# Altium project Hefesto.PrjPcb
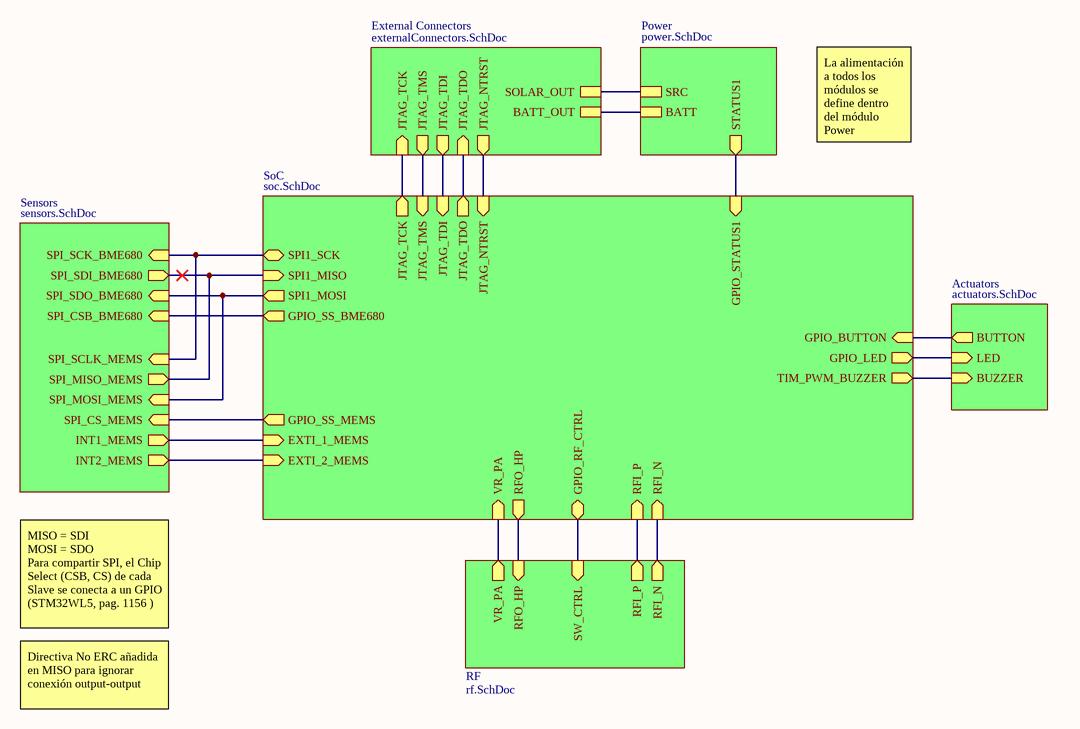
[diagram p0: main.SchDoc]
7 sheets, 68 parts. Net scope: hierarchical (ports join the sheet entries above them; power ports are global).
Board file: Hefesto.PcbDoc
Sheets:
  main.SchDoc
    SoC = soc.SchDoc
    Power = power.SchDoc
    RF = rf.SchDoc
    Actuators = actuators.SchDoc
    Sensors = sensors.SchDoc
    External Connectors = externalConnectors.SchDoc

## Sheet main.SchDoc: Hefesto
size A4; CheckedBy: None; DrawnBy: David, Andrea; DocumentNumber: 1; Revision: v1.0; SheetNumber: 1; SheetTotal: 7; Company: ETSIT; VersionRevision: v1.0; Project: Hefesto; TotalSheet: 7

### Sub-sheets
Actuators = actuators.SchDoc: BUTTON (out), LED (in), BUZZER (in)
External Connectors = externalConnectors.SchDoc: SOLAR_OUT, BATT_OUT, JTAG_TCK (in), JTAG_TMS (out), JTAG_TDI (out), JTAG_TDO (in), JTAG_NTRST (out)
Power = power.SchDoc: SRC, BATT, STATUS1 (out)
RF = rf.SchDoc: VR_PA (out), RFO_HP (in), RFI_P (out), RFI_N (out), SW_CTRL (in)
Sensors = sensors.SchDoc: SPI_SCLK_MEMS (in), SPI_MISO_MEMS (out), SPI_MOSI_MEMS (in), SPI_CS_MEMS (in), INT1_MEMS (out), INT2_MEMS (out), SPI_SCK_BME680 (in), SPI_SDI_BME680 (out), SPI_SDO_BME680 (in), SPI_CSB_BME680 (in)
SoC = soc.SchDoc: GPIO_BUTTON (in), GPIO_LED (out), TIM_PWM_BUZZER (out), GPIO_STATUS1 (in), JTAG_TCK (out), JTAG_TMS (in), JTAG_TDI (in), JTAG_TDO (out), SPI1_SCK (bidir), SPI1_MISO (in), SPI1_MOSI (out), GPIO_SS_BME680 (out), EXTI_1_MEMS (in), EXTI_2_MEMS (in), GPIO_SS_MEMS (out), VR_PA (in), RFO_HP (out), RFI_P (in), RFI_N (in), GPIO_RF_CTRL (bidir), JTAG_NTRST (in)

### Nets
RFI_N: sheet SoC/RFI_N, sheet RF/RFI_N
RFI_P: sheet SoC/RFI_P, sheet RF/RFI_P
NetB1_1: sheet SoC/GPIO_BUTTON, sheet Actuators/BUTTON
NetC19_2: sheet SoC/VR_PA, sheet RF/VR_PA
NetC31_2: sheet Power/BATT, sheet External Connectors/BATT_OUT
NetJ1_1: sheet Power/SRC, sheet External Connectors/SOLAR_OUT
NetJ3_3: sheet SoC/JTAG_TCK, sheet External Connectors/JTAG_TCK
NetJ3_4: sheet SoC/JTAG_TDO, sheet External Connectors/JTAG_TDO
NetJ3_5: sheet SoC/JTAG_TDI, sheet External Connectors/JTAG_TDI
NetJ3_6: sheet SoC/JTAG_TMS, sheet External Connectors/JTAG_TMS
NetJ3_7: sheet SoC/JTAG_NTRST, sheet External Connectors/JTAG_NTRST
NetL4_1: sheet SoC/RFO_HP, sheet RF/RFO_HP
NetR3_2: sheet SoC/GPIO_RF_CTRL, sheet RF/SW_CTRL
NetR7_2: sheet SoC/TIM_PWM_BUZZER, sheet Actuators/BUZZER
NetR9_2: sheet SoC/GPIO_LED, sheet Actuators/LED
NetU1_2: sheet SoC/GPIO_SS_BME680, sheet Sensors/SPI_CSB_BME680
NetU1_3: sheet SoC/SPI1_MISO, sheet Sensors/SPI_MISO_MEMS, sheet Sensors/SPI_SDI_BME680
NetU1_4: sheet SoC/SPI1_SCK, sheet Sensors/SPI_SCLK_MEMS, sheet Sensors/SPI_SCK_BME680
NetU1_5: sheet SoC/SPI1_MOSI, sheet Sensors/SPI_MOSI_MEMS, sheet Sensors/SPI_SDO_BME680
NetU2_8: sheet SoC/GPIO_SS_MEMS, sheet Sensors/SPI_CS_MEMS
NetU2_9: sheet SoC/EXTI_2_MEMS, sheet Sensors/INT2_MEMS
NetU2_11: sheet SoC/EXTI_1_MEMS, sheet Sensors/INT1_MEMS
NetU4_20: sheet SoC/GPIO_STATUS1, sheet Power/STATUS1

### Notes on the sheet
- La alimentación a todos los módulos se define dentro del módulo Power
- MISO = SDI                    MOSI = SDO                                                                                            Para compartir SPI, el Chip Select (CSB, CS) de cada Slave se conecta a un GPIO (STM32WL5, pag. 1156 )
- Directiva No ERC añadida en MISO para ignorar conexión output-output
- Title:
- Drawn By:
- Page Contents:
- Checked By:
- Size:
- Date:
- File:
- License:
- Email:
- A4
- Number:
- Time:
- Revision:
- Sheet
- Website:
- of

## Sheet soc.SchDoc: SoC
size A4; CheckedBy: None; DrawnBy: David, Andrea; Organization: ETSIT; DocumentNumber: 2; Revision: V1.0; SheetNumber: 2; SheetTotal: 7; SPICEModelCacheJYSJDKYB: <root> / <DocumentId>JYSJDKYB</DocumentId> / <CacheFrame Number="0"> / <Model Name="cap" Kind="MDL"> / <Text>*Default semiconductor capacitor / .MODEL CAP C()</Text> / </Model> / </CacheFrame> / </root>; TotalSheet: 7; VersionRevision: v1.0; Project: Hefesto; Company: ETSIT
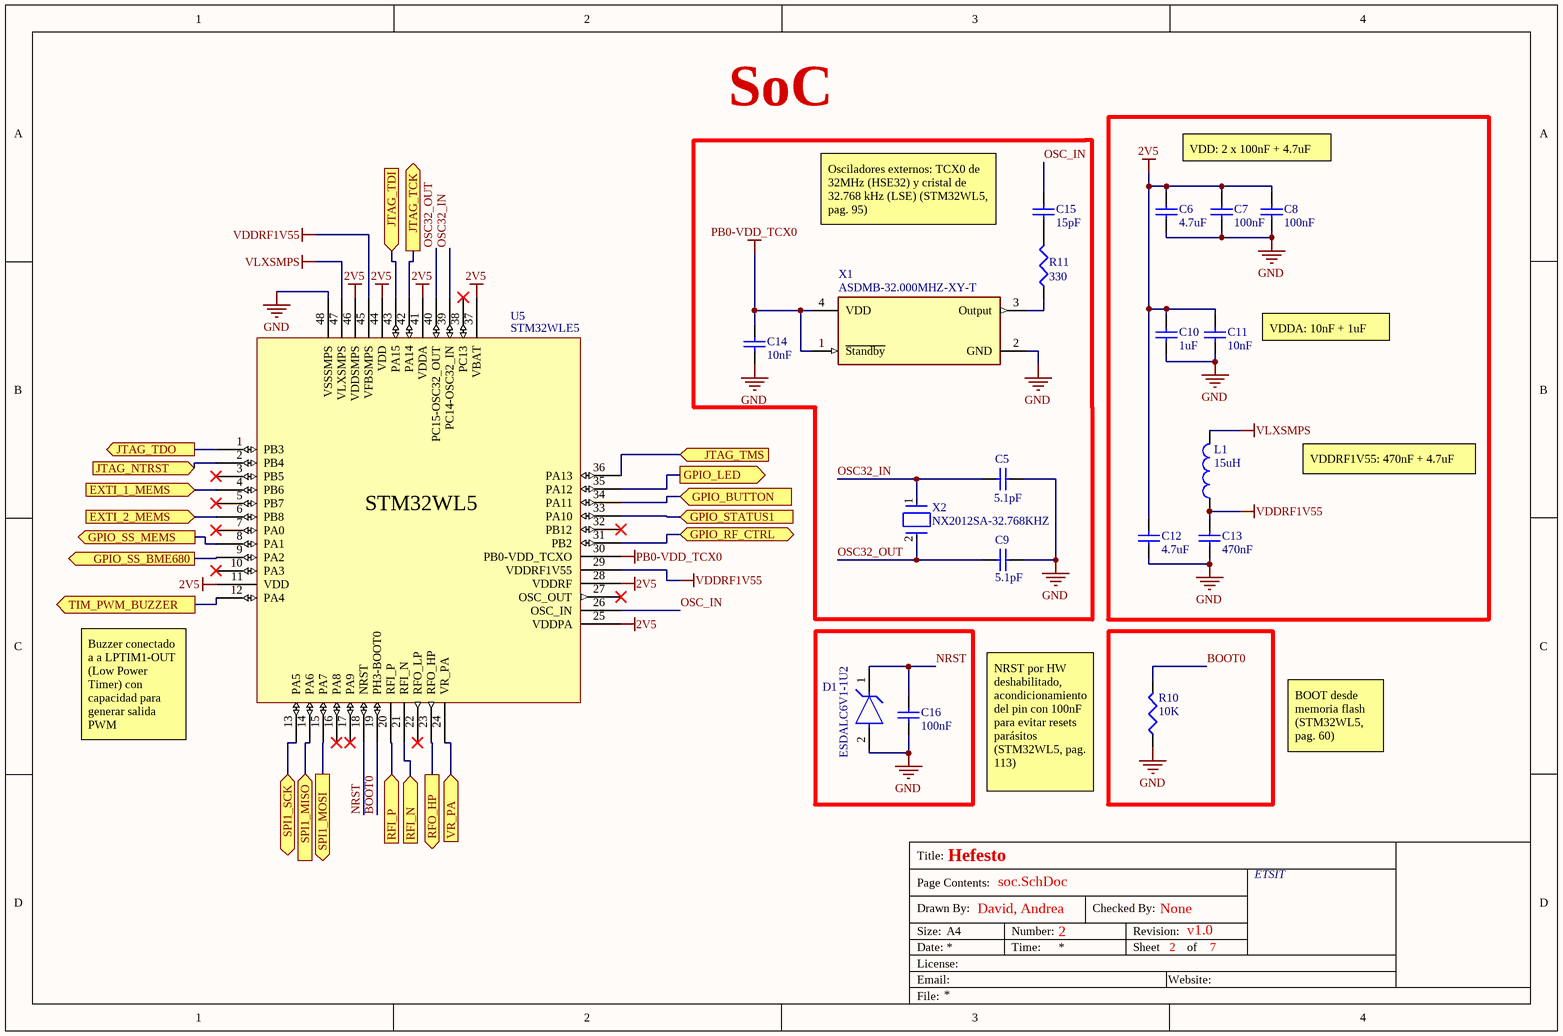
[diagram p1: soc.SchDoc]

### Parts
C5  value 5.1pF  [1608[0603]]  (hidden comment: Cap Semi)
C6  value 4.7uF  [1608[0603]]  (hidden comment: Cap Semi)
C7  value 100nF  [1608[0603]]  (hidden comment: Cap Semi)
C8  value 100nF  [1608[0603]]  (hidden comment: Cap Semi)
C9  value 5.1pF  [1608[0603]]  (hidden comment: Cap Semi)
C10  value 1uF  [1608[0603]]  (hidden comment: Cap Semi)
C11  value 10nF  [1608[0603]]  (hidden comment: Cap Semi)
C12  value 4.7uF  [1608[0603]]  (hidden comment: Cap Semi)
C13  value 470nF  [1608[0603]]  (hidden comment: Cap Semi)
C14  value 10nF  [1608[0603]]  (hidden comment: Cap Semi)
C15  value 15pF  [1608[0603]]  (hidden comment: Cap Semi)
C16  value 100nF  [1608[0603]]  (hidden comment: Cap Semi)
D1  ESDALC6V1-1U2  [FP-ST0201-MFG]
L1  value 15uH  [0603]  (hidden comment: Inductor)
R10  value 10K  [J1-0603]  (hidden comment: Res3)
R11  value 330  [J1-0603]  (hidden comment: Res3)
U5  STM32WLE5  [UFQFPN48]
X1  ASDMB-32.000MHZ-XY-T  [FP-ASDM-ASDMB-MFG]
X2  NX2012SA-32.768KHZ  [FP-NX2012SA-MFG]

### Ports
EXTI_1_MEMS (in, see main[2C]), EXTI_2_MEMS (in, see main[2C]), GPIO_BUTTON (in, see main[3B]), GPIO_LED (out, see main[3B]), GPIO_RF_CTRL (bidir, see main[3C]), GPIO_SS_BME680 (out, see main[2B]), GPIO_SS_MEMS (out, see main[2C]), GPIO_STATUS1 (in, see main[3B]), JTAG_NTRST (in, see main[2B], externalConnectors[3C]), JTAG_TCK (out, see main[2B], externalConnectors[3B]), JTAG_TDI (in, see main[2B], externalConnectors[3C]), JTAG_TDO (out, see main[2B], externalConnectors[3B]), JTAG_TMS (in, see main[2B], externalConnectors[3C]), RFI_N (in, see main[3C], rf[1C]), RFI_P (in, see main[3C], rf[1C]), RFO_HP (out, see main[2C], rf[1B]), SPI1_MISO (in, see main[2B]), SPI1_MOSI (out, see main[2B]), SPI1_SCK (bidir, see main[2B]), TIM_PWM_BUZZER (out, see main[3B]), VR_PA (in, see main[2C], rf[1B])

### Nets
2V5: C6.2 C7.2 C8.2 C10.2 C11.2 C12.2 U5.11(VDD) U5.25(VDDPA) U5.28(VDDRF) U5.37(VBAT) U5.41(VDDA) U5.44(VDD) U5.46(VDDSMPS)
GND: C5.1 C6.1 C7.1 C8.1 C9.1 C10.1 C11.1 C12.1 C13.1 C14.1 C16.1 D1.2(A) R10.1 U5.48(VSSSMPS) X1.2(GND)
PB0-VDD_TCX0: C14.2 U5.30(PB0-VDD_TCXO) X1.1(~{Standby}) X1.4(VDD)
VDDRF1V55: C13.2 L1.1 U5.29(VDDRF1V55) U5.45(VFBSMPS)
VLXSMPS: L1.2 U5.47(VLXSMPS)
BOOT0: R10.2 U5.19(PH3-BOOT0)
NRST: C16.2 D1.1(C) U5.18(NRST)
OSC32_IN: C5.2 U5.39(PC14-OSC32_IN) X2.1
OSC32_OUT: C9.2 U5.40(PC15-OSC32_OUT) X2.2
OSC_IN: C15.2 U5.26(OSC_IN)
RFI_N: U5.21(RFI_N) ; port RFI_N
RFI_P: U5.20(RFI_P) ; port RFI_P
NetB1_1: U5.34(PA11) ; port GPIO_BUTTON
NetC15_1: C15.1 R11.2
NetC19_2: U5.24(VR_PA) ; port VR_PA
NetJ3_3: U5.42(PA14) ; port JTAG_TCK
NetJ3_4: U5.1(PB3) ; port JTAG_TDO
NetJ3_5: U5.43(PA15) ; port JTAG_TDI
NetJ3_6: U5.36(PA13) ; port JTAG_TMS
NetJ3_7: U5.2(PB4) ; port JTAG_NTRST
NetL4_1: U5.23(RFO_HP) ; port RFO_HP
NetR3_2: U5.31(PB2) ; port GPIO_RF_CTRL
NetR7_2: U5.12(PA4) ; port TIM_PWM_BUZZER
NetR9_2: U5.35(PA12) ; port GPIO_LED
NetR11_1: R11.1 X1.3(Output)
NetU1_2: U5.9(PA2) ; port GPIO_SS_BME680
NetU1_3: U5.14(PA6) ; port SPI1_MISO
NetU1_4: U5.13(PA5) ; port SPI1_SCK
NetU1_5: U5.15(PA7) ; port SPI1_MOSI
NetU2_8: U5.8(PA1) ; port GPIO_SS_MEMS
NetU2_9: U5.6(PB8) ; port EXTI_2_MEMS
NetU2_11: U5.4(PB6) ; port EXTI_1_MEMS
NetU4_20: U5.33(PA10) ; port GPIO_STATUS1

Not connected (* = marked no-connect by the designer): U5 3(PB5)* 5(PB7)* 7(PA0)* 10(PA3)* 16(PA8)* 17(PA9)* 22(RFO_LP)* 27(OSC_OUT)* 32(PB12)* 38(PC13)*

### Notes on the sheet
- VDD: 2 x 100nF + 4.7uF
- Osciladores externos: TCX0 de 32MHz (HSE32) y cristal de 32.768 kHz (LSE) (STM32WL5, pag. 95)
- (near C11) VDDA: 10nF + 1uF
- VDDRF1V55: 470nF + 4.7uF
- Buzzer conectado a a LPTIM1-OUT (Low Power Timer) con capacidad para generar salida PWM
- NRST por HW deshabilitado, acondicionamiento del pin con 100nF para evitar resets parásitos (STM32WL5, pag. 113)
- BOOT desde memoria flash (STM32WL5, pag. 60)
- Title:
- Drawn By:
- Page Contents:
- Checked By:
- Size:
- Date:
- File:
- License:
- Email:
- A4
- Number:
- Time:
- Revision:
- Sheet
- Website:
- of
- (in symbol STM32WLE5) STM32WL5

### Library data of the parts
C5-C16 = Cap Semi: Capacitor (Semiconductor SIM Model); Published: 8-Jun-2000; LatestRevisionDate: 29-May-2009; LatestRevisionNote: IPC-7351 Footprint Added.; PackageReference: C1206; Publisher: Altium Limited; PackageDescription: Chip Capacitor
D1 = CMP-12225-000007-1: TVS DIODE 3V ST0201; Manufacturer: STMicroelectronics; Number Of Channels: 1; Direction: Unidirectional; Max Junction Temp: +125°C; Breakdown Voltage: 6.1V; Capacitance: 12pF; Peak Pulse Current: 2A; Value: 12pF; Peak Pulse Power: 20W; Package: ST0201; Digikey Description: TVS DIODE 3V ST0201; Temperature Range High: +125°C; Octopart: https://octopart.com/esdalc6v1-1u2-stmicroelectronics-11912330; Category: Diode; Height: 0.33mm; RoHS: TRUE; ComponentLink2URL: https://www.st.com/content/ccc/resource/technical/document/datasheet/90/b1/aa/a3/9f/73/4d/1e/CD00212838.pdf/files/CD00212838.pdf/jcr:content/translations/en.CD00212838.pdf; Temperature Range Low: -40°C; Device Class L2: TVS Diodes; ComponentLink2Description: Datasheet; Manufacturer Part Number: ESDALC6V1-1U2; Device Class L1: Circuit Protection; Device Class L3: unset; Lead Free: Yes; Automotive: No; Mouser Description: TVS Diodes - Transient Voltage Suppressors Single-Line Low Cap ESD TVS 0201; Temperature: -40°C to +125°C
L1 = Inductor: Code_IEC: 1005; Published: 8-Jun-2000; LatestRevisionDate: 29-May-2009; LatestRevisionNote: IPC-7351 Footprint Added.; PackageReference: 0402-A; Publisher: Altium Limited; PackageDescription: Chip Inductor; Code_JEITA: 0402
R10 R11 = Res3: Resistor; Published: 8-Jun-2000; LatestRevisionDate: 29-May-2009; LatestRevisionNote: IPC-7351 Footprint Added.; PackageReference: J1-0603; Publisher: Altium Limited; PackageDescription: Chip Resistor
X1 = CMP-27762-009266-1: MEMS Oscillator 32MHz ±10ppm LVCMOS 1.8V~3.3V SMD 2.5x2mm; Operating Supply Voltage: 3.6V; Max Supply Current: 16mA; Load Capacitance: 15pF; Length: 0.098inch; Min Operating Temperature: -40°C; Case/Package: SMD/SMT; Number of Pins: 4; RoHS Compliant: Yes; Frequency Stability: 10ppm; Height: 0.035inch; Frequency: 32MHz; Packaging: Tape and Reel; Width: 0.079inch; Termination: SMD/SMT; Radiation Hardening: No; Max Operating Temperature: 105°C; Series: Pure Silicon™ ASDMB; Mount: Surface Mount
X2 = CMP-200220-000014-1: CRYSTAL 32.7680KHZ 6PF SMD

## Sheet power.SchDoc: Power
size A4; CheckedBy: None; DrawnBy: David, Andrea; DocumentNumber: 3; Revision: v1.0; SheetNumber: 3; SheetTotal: 7; SPICEModelCacheWKKYIPZN: <root> / <DocumentId>WKKYIPZN</DocumentId> / <CacheFrame Number="0"> / <Model Name="cap" Kind="MDL"> / <Text>*Default semiconductor capacitor / .MODEL CAP C()</Text> / </Model> / </CacheFrame> / </root>; VersionRevision: v1.0; TotalSheet: 7; Company: ETSIT; Project: Hefesto
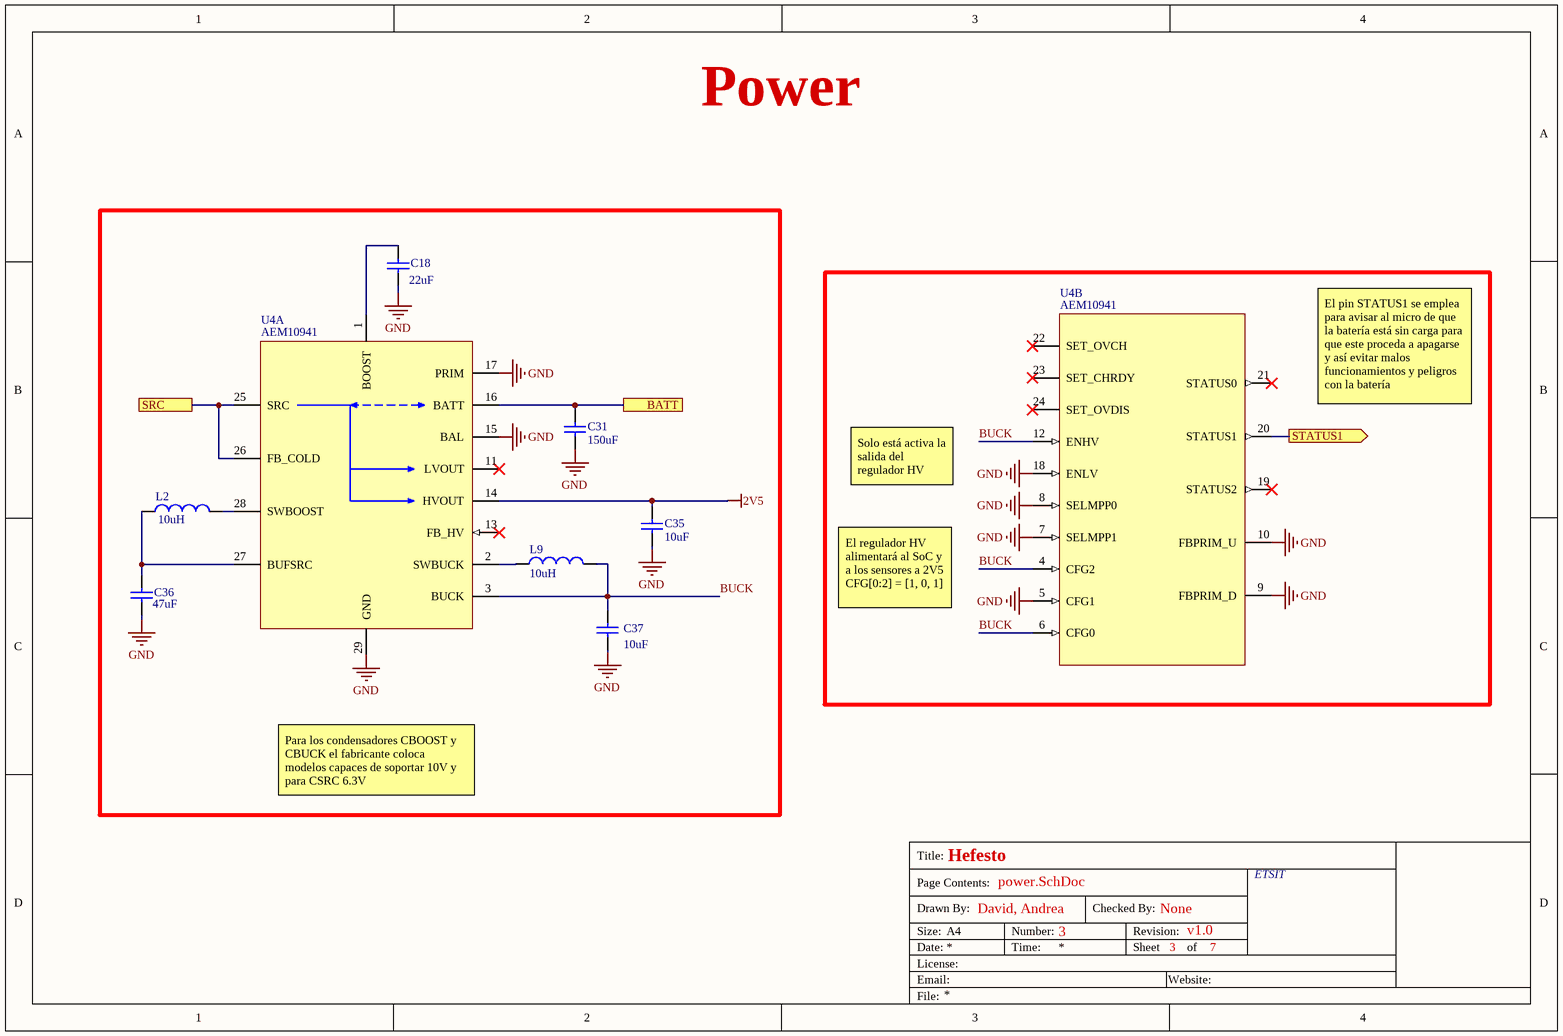
[diagram p2: power.SchDoc]

### Parts
C18  value 22uF  [1608[0603]]  (hidden comment: Cap Semi)
C31  value 150uF  [1608[0603]]
C35  value 10uF  [1608[0603]]
C36  value 47uF  [1608[0603]]  (hidden comment: Cap Semi)
C37  value 10uF  [1608[0603]]
L2  LBOOST: 10uH  [0603]
L9  LBOOST: 10uH  [0603]
U4  AEM10941  [AEM10941]  (parts A,B of 2)

### Ports
BATT (see main[3A]), SRC (see main[3A]), STATUS1 (out, see main[3B])

### Nets
2V5: C35.2 U4.14(HVOUT)
GND: C18.1 C31.1 C35.1 C36.1 C37.1 U4.5(CFG1) U4.7(SELMPP1) U4.8(SELMPP0) U4.9(FBPRIM_D) U4.10(FBPRIM_U) U4.15(BAL) U4.17(PRIM) U4.18(ENLV) U4.29(GND)
BUCK: C37.2 L9.1 U4.3(BUCK) U4.4(CFG2) U4.6(CFG0) U4.12(ENHV)
NetC18_2: C18.2 U4.1(BOOST)
NetC31_2: C31.2 U4.16(BATT) ; port BATT
NetC36_2: C36.2 L2.1 U4.27(BUFSRC)
NetJ1_1: U4.25(SRC) U4.26(FB_COLD) ; port SRC
NetL2_2: L2.2 U4.28(SWBOOST)
NetL9_2: L9.2 U4.2(SWBUCK)
NetU4_20: U4.20(STATUS1) ; port STATUS1

Not connected (* = marked no-connect by the designer): U4 11(LVOUT)* 13(FB_HV)* 19(STATUS2)* 21(STATUS0)* 22(SET_OVCH)* 23(SET_CHRDY)* 24(SET_OVDIS)*

### Notes on the sheet
- El pin STATUS1 se emplea para avisar al micro de que la batería está sin carga para que este proceda a apagarse y así evitar malos funcionamientos y peligros con la batería
- Solo está activa la salida del regulador HV
- El regulador HV alimentará al SoC y a los sensores a 2V5              CFG[0:2] = [1, 0, 1]
- Para los condensadores CBOOST y CBUCK el fabricante coloca modelos capaces de soportar 10V y para CSRC 6.3V
- Title:
- Drawn By:
- Page Contents:
- Checked By:
- Size:
- Date:
- File:
- License:
- Email:
- A4
- Number:
- Time:
- Revision:
- Sheet
- Website:
- of

### Library data of the parts
C18 C31 C35-C37 = Cap Semi: Capacitor (Semiconductor SIM Model); Published: 8-Jun-2000; LatestRevisionDate: 29-May-2009; LatestRevisionNote: IPC-7351 Footprint Added.; PackageReference: C1206; Publisher: Altium Limited; PackageDescription: Chip Capacitor
L2 L9 = Inductor: Code_IEC: 1005; Published: 8-Jun-2000; LatestRevisionDate: 29-May-2009; LatestRevisionNote: IPC-7351 Footprint Added.; PackageReference: 0402-A; Publisher: Altium Limited; PackageDescription: Chip Inductor; Code_JEITA: 0402
U4 = AEM10941: AEM10941 - Symbol QFN28

## Sheet rf.SchDoc: RF
size A4; CheckedBy: None; DrawnBy: David, Andrea; DocumentNumber: 6; SheetNumber: 6; SheetTotal: 7; Project: Hefesto; VersionRevision: v1.0; SPICEModelCacheBOYTSJFF: <root> / <DocumentId>BOYTSJFF</DocumentId> / <CacheFrame Number="0"> / <Model Name="cap" Kind="MDL"> / <Text>*Default semiconductor capacitor / .MODEL CAP C()</Text> / </Model> / </CacheFrame> / </root>; TotalSheet: 7; Company: ETSIT
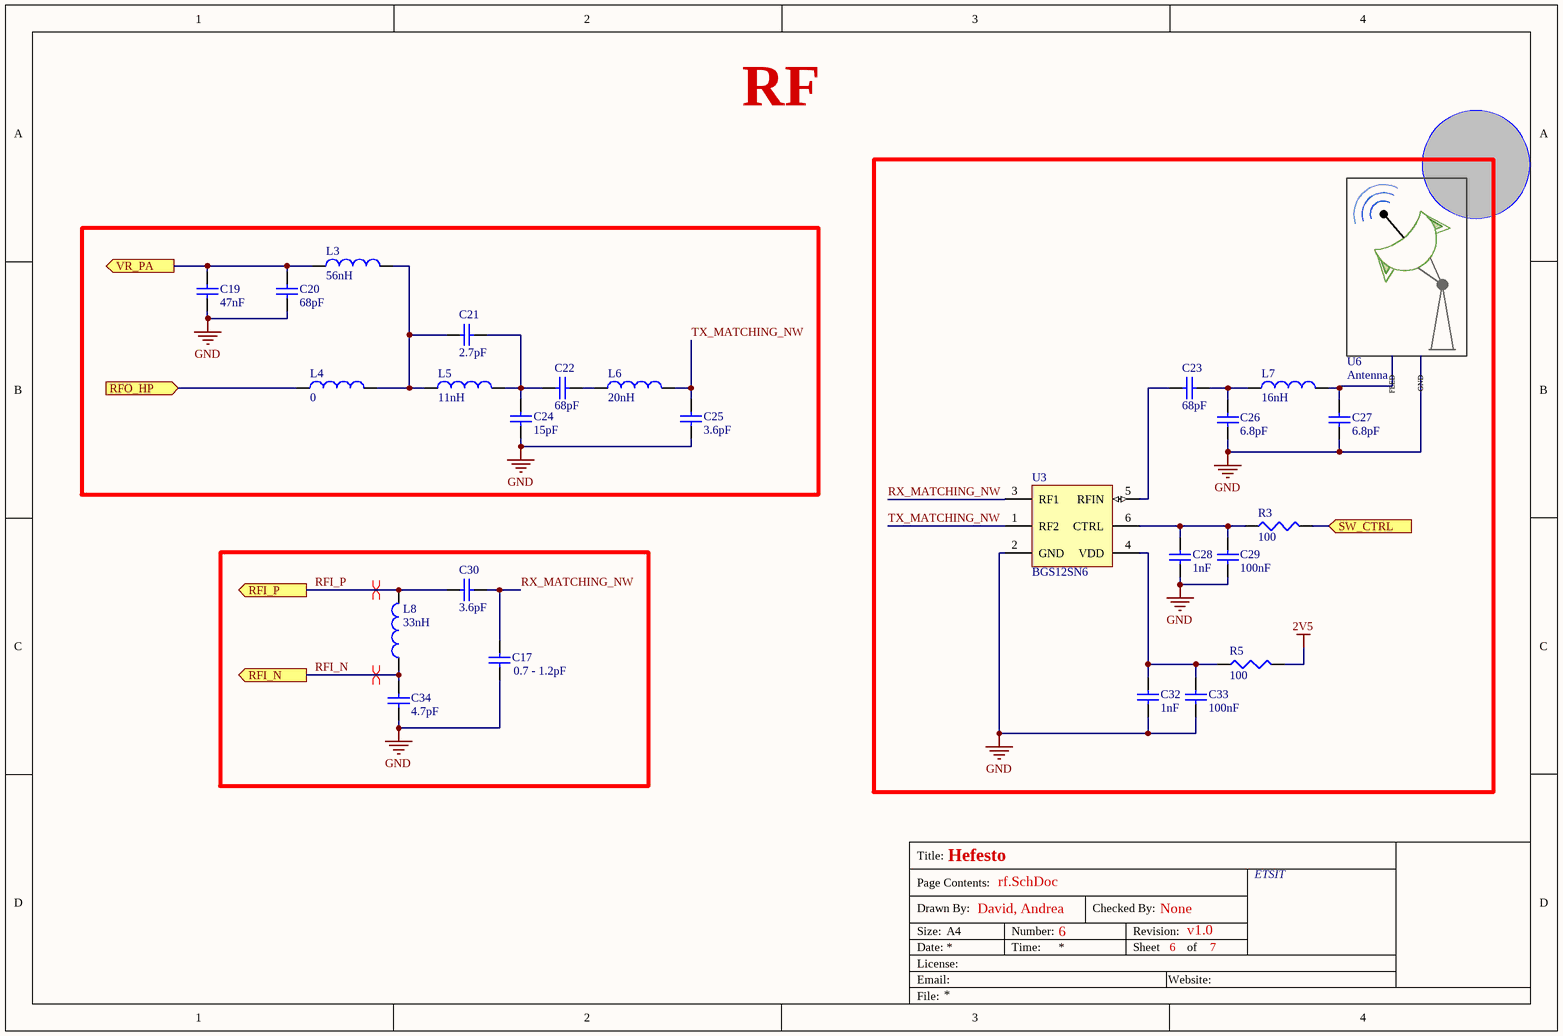
[diagram p3: rf.SchDoc]

### Parts
C17  value 0.7 - 1.2pF  [1608[0603]]  (hidden comment: Cap Semi)
C19  value 47nF  [1608[0603]]  (hidden comment: Cap Semi)
C20  value 68pF  [1608[0603]]  (hidden comment: Cap Semi)
C21  value 2.7pF  [1608[0603]]  (hidden comment: Cap Semi)
C22  value 68pF  [1608[0603]]  (hidden comment: Cap Semi)
C23  value 68pF  [1608[0603]]  (hidden comment: Cap Semi)
C24  value 15pF  [1608[0603]]  (hidden comment: Cap Semi)
C25  value 3.6pF  [1608[0603]]  (hidden comment: Cap Semi)
C26  value 6.8pF  [1608[0603]]  (hidden comment: Cap Semi)
C27  value 6.8pF  [1608[0603]]  (hidden comment: Cap Semi)
C28  value 1nF  [1608[0603]]  (hidden comment: Cap Semi)
C29  value 100nF  [1608[0603]]  (hidden comment: Cap Semi)
C30  value 3.6pF  [1608[0603]]  (hidden comment: Cap Semi)
C32  value 1nF  [1608[0603]]  (hidden comment: Cap Semi)
C33  value 100nF  [1608[0603]]  (hidden comment: Cap Semi)
C34  value 4.7pF  [1608[0603]]  (hidden comment: Cap Semi)
L3  value 56nH  [0603]  (hidden comment: Inductor)
L4  value 0  [0603]  (hidden comment: Inductor)
L5  value 11nH  [0603]  (hidden comment: Inductor)
L6  value 20nH  [0603]  (hidden comment: Inductor)
L7  value 16nH  [0603]  (hidden comment: Inductor)
L8  value 33nH  [0603]  (hidden comment: Inductor)
R3  value 100  [J1-0603]  (hidden comment: Res3)
R5  value 100  [J1-0603]  (hidden comment: Res3)
U3  BGS12SN6  [INF-TSNP-6-2_V]
U6  Antenna  [Antenna_SWRA228]

### Ports
RFI_N (out, see main[3C], soc[2D]), RFI_P (out, see main[3C], soc[1D]), RFO_HP (in, see main[2C], soc[2D]), SW_CTRL (in, see main[3C]), VR_PA (out, see main[2C], soc[2D])

### Nets
2V5: R5.2
GND: C17.1 C19.1 C20.1 C24.1 C25.1 C26.2 C27.2 C28.2 C29.2 C32.2 C33.2 C34.1 U3.2(GND) U6.0(GND)
RFI_N: C34.2 L8.1 ; port RFI_N
RFI_P: C30.2 L8.2 ; port RFI_P
RX_MATCHING_NW: C17.2 C30.1 U3.3(RF1)
TX_MATCHING_NW: C25.2 L6.2 U3.1(RF2)
NetC19_2: C19.2 C20.2 L3.1 ; port VR_PA
NetC21_1: C21.1 C22.2 C24.2 L5.2
NetC21_2: C21.2 L3.2 L4.2 L5.1
NetC22_1: C22.1 L6.1
NetC23_1: C23.1 C26.1 L7.1
NetC23_2: C23.2 U3.5(RFIN)
NetC27_1: C27.1 L7.2 U6.1(FEED)
NetC28_1: C28.1 C29.1 R3.1 U3.6(CTRL)
NetC32_1: C32.1 C33.1 R5.1 U3.4(VDD)
NetL4_1: L4.1 ; port RFO_HP
NetR3_2: R3.2 ; port SW_CTRL

### Layout directives
differential pair: RFI_N, RFI_P

### Notes on the sheet
- Title:
- Drawn By:
- Page Contents:
- Checked By:
- Size:
- Date:
- File:
- License:
- Email:
- A4
- Number:
- Time:
- Revision:
- Sheet
- Website:
- of

### Library data of the parts
C17 C19-C30 C32-C34 = Cap Semi: Capacitor (Semiconductor SIM Model); Published: 8-Jun-2000; LatestRevisionDate: 29-May-2009; LatestRevisionNote: IPC-7351 Footprint Added.; PackageReference: C1206; Publisher: Altium Limited; PackageDescription: Chip Capacitor
L3-L8 = Inductor: Code_IEC: 1005; Published: 8-Jun-2000; LatestRevisionDate: 29-May-2009; LatestRevisionNote: IPC-7351 Footprint Added.; PackageReference: 0402-A; Publisher: Altium Limited; PackageDescription: Chip Inductor; Code_JEITA: 0402
R3 R5 = Res3: Resistor; Published: 8-Jun-2000; LatestRevisionDate: 29-May-2009; LatestRevisionNote: IPC-7351 Footprint Added.; PackageReference: J1-0603; Publisher: Altium Limited; PackageDescription: Chip Resistor
U3 = CMP-1088-00016-1: Wideband RF SPDT Switch, 0.1 to 6 GHz, TSNP-6, Reel, Green; Manufacturer: Infineon; Green: TRUE; Supply Voltage Range: 1.8 - 3.5; Packing: Tape and Reel; Isolation @1GHz: 40 dB; Insertion Loss @1GHz: 0.25 dB; Pmax: 30 dBm; ComponentLink2URL: http://www.infineon.com/dgdl/BGS12SN6_2014-05-23.pdf?folderId=db3a30431f848401011fcbf2ab4c04c4&fileId=db3a30433f1b26e8013f2db58bc03856; PackageReference: TSNP-6-2; PartNumber: BGS12SN6; DatasheetVersion: Rev. 1.2; ComponentLink3URL: http://www.infineon.com/dgdl/TSNP-6-2-Package_Overview.pdf?folderId=db3a304327b89750012805e1379a6124&fileId=db3a30433c6612b1013c6bcb02293ba1; ComponentLink2Description: Datasheet; PackageDescription: 6-Pin Thin Small Non Leaded Package, 1.1 x 0.7 mm Body, 0.4 mm Pitch; ComponentLink1URL: http://www.infineon.com/; Frequency ( f ) Range: 0.1 to 6 GHz; Switch Type: SPDT; Mounting Technology: Surface Mount; Halogen-free: TRUE; PackageVersion: Jan-13; ComponentLink3Description: Package Specification; ComponentLink1Description: Manufacturer URL

## Sheet actuators.SchDoc: Actuators
size A4; CheckedBy: None; CompanyName: ETSIT; DrawnBy: David, Andrea; DocumentNumber: 5; SheetNumber: 5; SheetTotal: 7; TotalSheet: 7; VersionRevision: v1.0; Project: Hefesto; Company: ETSIT
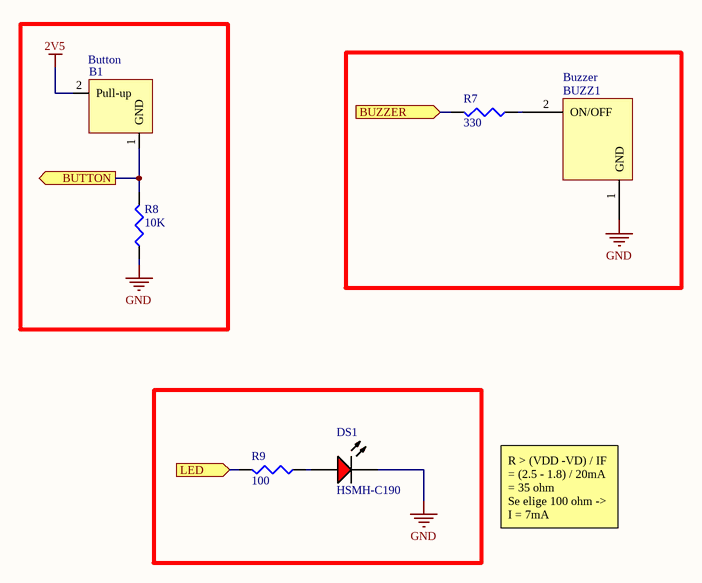
[diagram p4: actuators.SchDoc]

### Parts
B1  Button  [Button]
BUZZ1  Buzzer  [SOP_Buzzer]
DS1  HSMH-C190  [AVAG-HSMX-C190_V]
R7  value 330  [J1-0603]  (hidden comment: Res3)
R8  value 10K  [J1-0603]  (hidden comment: Res3)
R9  value 100  [J1-0603]  (hidden comment: Res3)

### Ports
BUTTON (out, see main[4B]), BUZZER (in, see main[4B]), LED (in, see main[4B])

### Nets
2V5: B1.2(Pull-up)
GND: BUZZ1.1(GND) DS1.2(K) R8.1
NetB1_1: B1.1(GND) R8.2 ; port BUTTON
NetBUZZ1_2: BUZZ1.2(ON/OFF) R7.1
NetDS1_1: DS1.1(A) R9.1
NetR7_2: R7.2 ; port BUZZER
NetR9_2: R9.2 ; port LED

### Notes on the sheet
- R > (VDD -VD) / IF = (2.5 - 1.8) / 20mA = 35 ohm                                       Se elige 100 ohm -> I = 7mA
- Title:
- Drawn By:
- Page Contents:
- Checked By:
- Size:
- Date:
- File:
- License:
- Email:
- A4
- Number:
- Time:
- Revision:
- Sheet
- Website:
- of

### Library data of the parts
DS1 = CMP-1744-00004-1: LED Uni-Color Red, 65 mW, 20 mA, -40 to 85 degC, 2-Pin SMD, RoHS, Tape and Reel; Connector Type: USB; Gender: Male; Current Rating: 1 A; Length: 7.5 mm; Lead Pitch: 0.65 mm; PackageReference: HSMX-C190; Package Quantity: 2000; Max Operating Temperature: 85 degC; PackageDescription: 2-Pin Surface Mount Device, Body 1.6 x 0.8 mm, Height 0.9 mm; ComponentLink3Description: Package Specification; Mount: Surface Mount; Min Operating Temperature: -30 degC; ComponentLink3URL: http://www.fairchildsemi.com/dwg/MA/MA03D.pdf; ComponentLink1Description: Manufacturer URL; Contact Material: Copper; Pins: 5; Width: 5.6 mm; ComponentLink2Description: Datasheet; RoHSCompliant: true; DatasheetVersion: Mar-12; Height: 2.8 mm; Packaging: Tape and Reel; Contact Plating: Gold; ComponentLink1URL: http://www.avagotech.com/; REACH SVHC: No SVHC; ComponentLink2URL: http://docs.avagotech.com/docs/AV02-0551EN
R7-R9 = Res3: Resistor; Published: 8-Jun-2000; LatestRevisionDate: 29-May-2009; LatestRevisionNote: IPC-7351 Footprint Added.; PackageReference: J1-0603; Publisher: Altium Limited; PackageDescription: Chip Resistor

## Sheet sensors.SchDoc: Sensors
size A4; CheckedBy: None; DrawnBy: David, Andrea; DocumentNumber: 4; Revision: V1.0; SheetNumber: 4; SheetTotal: 7; Project: Hefesto; VersionRevision: v1.0; Company: ETSIT; SPICEModelCacheYRUZWUHL: <root> / <DocumentId>YRUZWUHL</DocumentId> / <CacheFrame Number="0"> / <Model Name="cap" Kind="MDL"> / <Text>*Default semiconductor capacitor / .MODEL CAP C()</Text> / </Model> / </CacheFrame> / </root>; TotalSheet: 7; Application_BuildNumber: 4
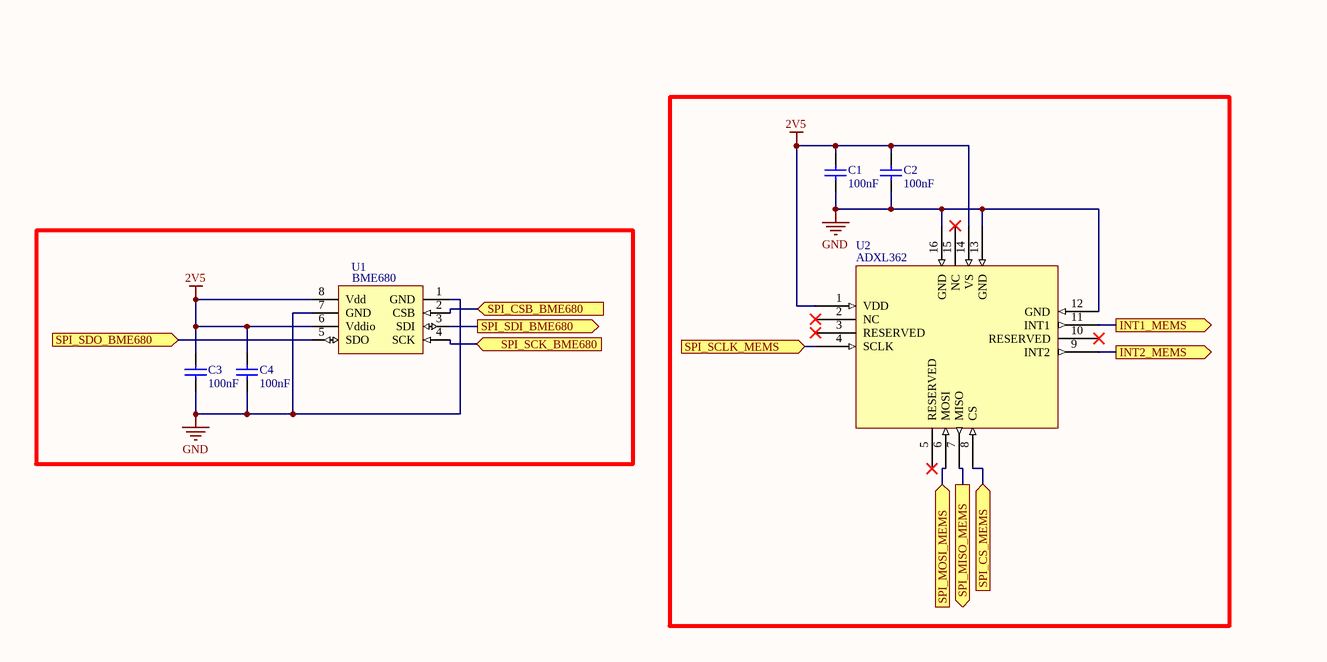
[diagram p5: sensors.SchDoc, left]

### Parts
C1  value 100nF  [1608[0603]]  (hidden comment: Cap Semi)
C2  value 100nF  [1608[0603]]  (hidden comment: Cap Semi)
C3  value 100nF  [1608[0603]]  (hidden comment: Cap Semi)
C4  value 100nF  [1608[0603]]  (hidden comment: Cap Semi)
U1  BME680  [BME680]  (value not drawn)
U2  ADXL362  [ADLX362FP]

### Ports
INT1_MEMS (out, see main[2C]), INT2_MEMS (out, see main[2C]), SPI_CS_MEMS (in, see main[2C]), SPI_CSB_BME680 (in, see main[2B]), SPI_MISO_MEMS (out, see main[2B]), SPI_MOSI_MEMS (in, see main[2C]), SPI_SCK_BME680 (in, see main[2B]), SPI_SCLK_MEMS (in, see main[2B]), SPI_SDI_BME680 (out, see main[2B]), SPI_SDO_BME680 (in, see main[2B])

### Nets
2V5: C1.2 C2.2 C3.2 C4.2 U1.6(Vddio) U1.8(Vdd) U2.1(VDD) U2.14(VS)
GND: C1.1 C2.1 C3.1 C4.1 U1.1(GND) U1.7(GND) U2.12(GND) U2.13(GND) U2.16(GND)
NetU1_2: U1.2(CSB) ; port SPI_CSB_BME680
NetU1_3: U1.3(SDI) U2.7(MISO) ; port SPI_SDI_BME680, port SPI_MISO_MEMS
NetU1_4: U1.4(SCK) U2.4(SCLK) ; port SPI_SCK_BME680, port SPI_SCLK_MEMS
NetU1_5: U1.5(SDO) U2.6(MOSI) ; port SPI_SDO_BME680, port SPI_MOSI_MEMS
NetU2_8: U2.8(CS) ; port SPI_CS_MEMS
NetU2_9: U2.9(INT2) ; port INT2_MEMS
NetU2_11: U2.11(INT1) ; port INT1_MEMS

Not connected (* = marked no-connect by the designer): U2 2(NC)* 3(RESERVED)* 5(RESERVED)* 10(RESERVED)* 15(NC)*

### Notes on the sheet
- Title:
- Drawn By:
- Page Contents:
- Checked By:
- Size:
- Date:
- File:
- License:
- Email:
- A4
- Number:
- Time:
- Revision:
- Sheet
- Website:
- of

### Library data of the parts
C1-C4 = Cap Semi: Capacitor (Semiconductor SIM Model); Published: 8-Jun-2000; LatestRevisionDate: 29-May-2009; LatestRevisionNote: IPC-7351 Footprint Added.; PackageReference: C1206; Publisher: Altium Limited; PackageDescription: Chip Capacitor

## Sheet externalConnectors.SchDoc: External Connectors
size A4; CheckedBy: None; DrawnBy: David, Andrea; Organization: ETSIT; DocumentNumber: 7; Revision: V1.0; SheetNumber: 7; SheetTotal: 7; Company: ETSIT; VersionRevision: v1.0; TotalSheet: 7; Project: Hefesto
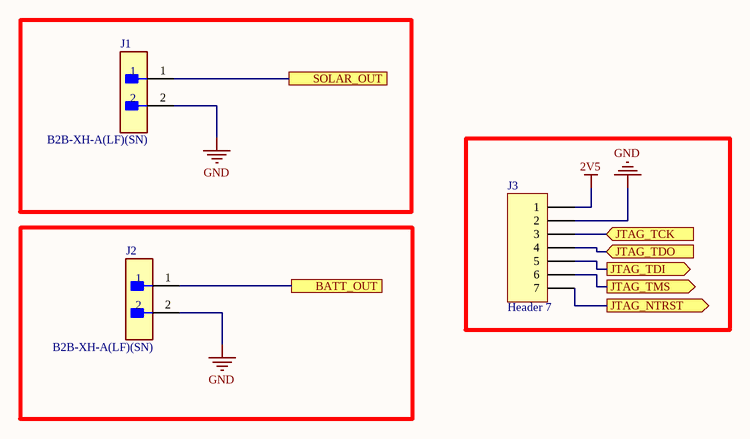
[diagram p6: externalConnectors.SchDoc]

### Parts
J1  B2B-XH-A(LF)(SN)  [FP-B2B-XH-A_LF_SN-MFG]
J2  B2B-XH-A(LF)(SN)  [FP-B2B-XH-A_LF_SN-MFG]
J3  Header 7  [HDR1X7]

### Ports
BATT_OUT (see main[3A]), JTAG_NTRST (out, see main[2B], soc[1B]), JTAG_TCK (in, see main[2B], soc[2A]), JTAG_TDI (out, see main[2B], soc[1A]), JTAG_TDO (in, see main[2B], soc[1B]), JTAG_TMS (out, see main[2B], soc[2B]), SOLAR_OUT (see main[3A])

### Nets
2V5: J3.1
GND: J1.2 J2.2 J3.2
NetC31_2: J2.1 ; port BATT_OUT
NetJ1_1: J1.1 ; port SOLAR_OUT
NetJ3_3: J3.3 ; port JTAG_TCK
NetJ3_4: J3.4 ; port JTAG_TDO
NetJ3_5: J3.5 ; port JTAG_TDI
NetJ3_6: J3.6 ; port JTAG_TMS
NetJ3_7: J3.7 ; port JTAG_NTRST

### Notes on the sheet
- Title:
- Drawn By:
- Page Contents:
- Checked By:
- Size:
- Date:
- File:
- License:
- Email:
- A4
- Number:
- Time:
- Revision:
- Sheet
- Website:
- of

### Library data of the parts
J1 J2 = CMP-2000-05888-3: CONN HEADER VERT 2POS 2.5MM; Current Rating: 3A; Voltage Rating: 250V; Number of Contacts: 2; Contact Resistance: 20mR; Wire/Cable Gauge: 22AWG; Insulation Resistance: 1GR; Connector Type: Male Pin; Packaging: Bulk; Contact Material: Brass; Lead Free: Lead Free; Orientation: Straight; Contact Plating: Tin; Max Current Rating: 3A; Termination: Solder; Fastening Type: Detent; Depth: 5.75mm; Housing Material: Polyamide; REACH SVHC: No SVHC; Series: XH; Voltage Rating (AC): 250V; Number of Positions: 2; Color: Natural; Contact Type: Male Pin; Max Voltage Rating (DC): 250V; Pitch: 2.5mm; Lead Pitch: 2.5mm; Mount: Through Hole; Max Operating Temperature: 85°C; Length: 7.4mm; Max Voltage Rating (AC): 250V; Min Operating Temperature: -25°C; Number of Rows: 1; Housing Color: White
J3 = Header 7: Header, 7-Pin; LatestRevisionDate: 17-Jul-2002; LatestRevisionNote: Re-released for DXP Platform.; Publisher: Altium Limited

## Nets that join several sheets
2V5: soc (13 pins), power (C35.2 U4.14), rf (R5.2), actuators (B1.2), sensors (8 pins), externalConnectors (J3.1)
GND: soc (15 pins), power (14 pins), rf (14 pins), actuators (BUZZ1.1 DS1.2 R8.1), sensors (9 pins), externalConnectors (J1.2 J2.2 J3.2)
NetB1_1: soc (U5.34), actuators (B1.1 R8.2)
NetC19_2: soc (U5.24), rf (C19.2 C20.2 L3.1)
NetC31_2: power (C31.2 U4.16), externalConnectors (J2.1)
NetJ1_1: power (U4.25 U4.26), externalConnectors (J1.1)
NetJ3_3: soc (U5.42), externalConnectors (J3.3)
NetJ3_4: soc (U5.1), externalConnectors (J3.4)
NetJ3_5: soc (U5.43), externalConnectors (J3.5)
NetJ3_6: soc (U5.36), externalConnectors (J3.6)
NetJ3_7: soc (U5.2), externalConnectors (J3.7)
NetL4_1: soc (U5.23), rf (L4.1)
NetR3_2: soc (U5.31), rf (R3.2)
NetR7_2: soc (U5.12), actuators (R7.2)
NetR9_2: soc (U5.35), actuators (R9.2)
NetU1_2: soc (U5.9), sensors (U1.2)
NetU1_3: soc (U5.14), sensors (U1.3 U2.7)
NetU1_4: soc (U5.13), sensors (U1.4 U2.4)
NetU1_5: soc (U5.15), sensors (U1.5 U2.6)
NetU2_8: soc (U5.8), sensors (U2.8)
NetU2_9: soc (U5.6), sensors (U2.9)
NetU2_11: soc (U5.4), sensors (U2.11)
NetU4_20: soc (U5.33), power (U4.20)
RFI_N: soc (U5.21), rf (C34.2 L8.1)
RFI_P: soc (U5.20), rf (C30.2 L8.2)